# EAGLE design hdmi (EAGLE 7.3.0)
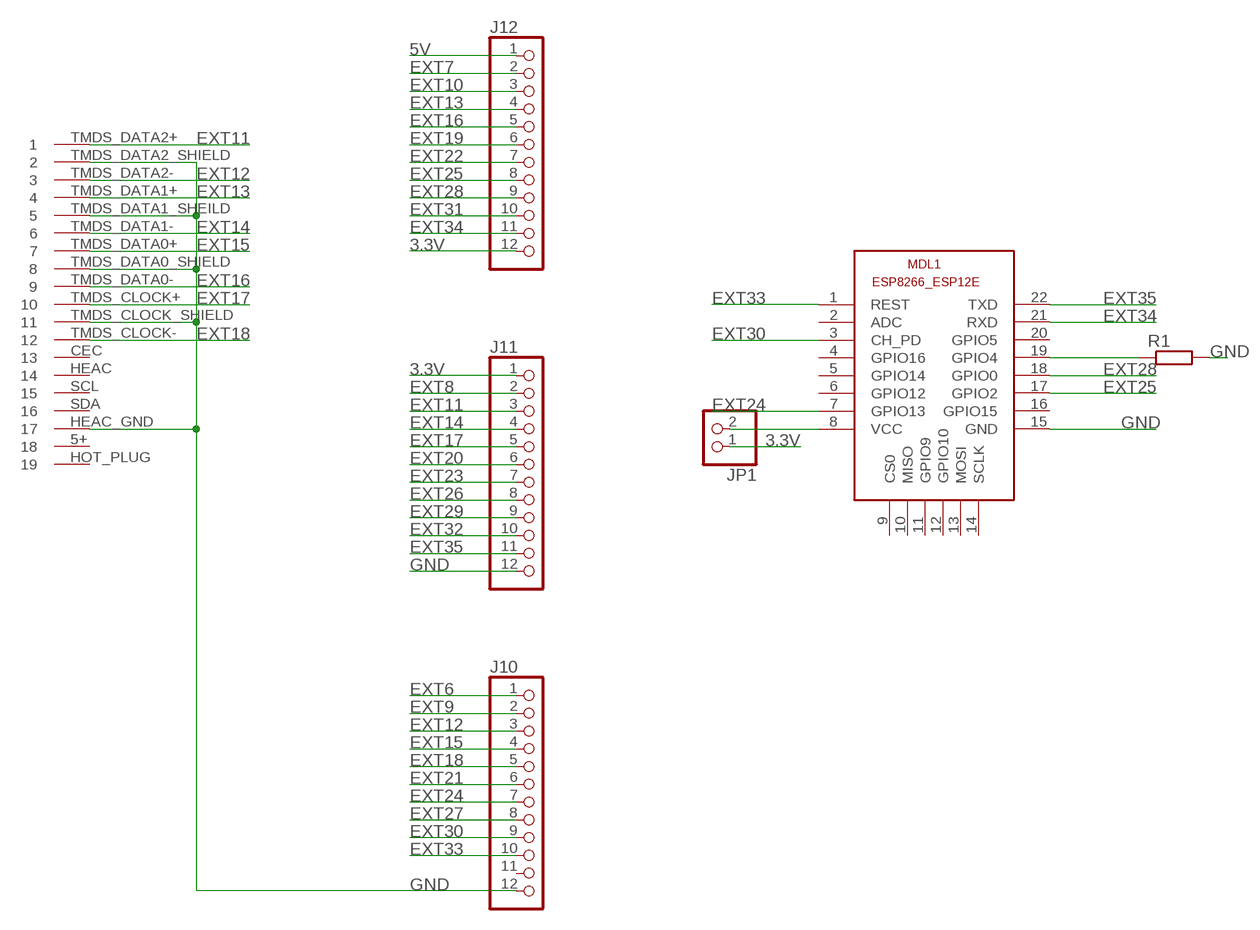
[diagram p0: schematic, sheet 1]

## Parts
J10  PINHD-1X12  [1X12]
J11  PINHD-1X12  [1X12]
J12  PINHD-1X12  [1X12]
JP1  PINHD-1X2/90  [1X02/90]
MDL1  ESP8266-12EESP8266-ESP12E  [ESP8266-ESP12E]
R1  R-EU_M0805  [M0805]
U$2  HDMI  [DS1115]

## Nets
3.3V: J11.1 J12.12 JP1.1
5V: J12.1
EXT6: J10.1
EXT7: J12.2
EXT8: J11.2
EXT9: J10.2
EXT10: J12.3
EXT11: J11.3 U$2.TMDS_DATA2+
EXT12: J10.3 U$2.TMDS_DATA2-
EXT13: J12.4 U$2.TMDS_DATA1+
EXT14: J11.4 U$2.TMDS_DATA1-
EXT15: J10.4 U$2.TMDS_DATA0+
EXT16: J12.5 U$2.TMDS_DATA0-
EXT17: J11.5 U$2.TMDS_CLOCK+
EXT18: J10.5 U$2.TMDS_CLOCK-
EXT19: J12.6
EXT20: J11.6
EXT21: J10.6
EXT22: J12.7
EXT23: J11.7
EXT24: J10.7 MDL1.7(GPIO13)
EXT25: J12.8 MDL1.17(GPIO2)
EXT26: J11.8
EXT27: J10.8
EXT28: J12.9 MDL1.18(GPIO0)
EXT29: J11.9
EXT30: J10.9 MDL1.3(CH_PD)
EXT31: J12.10
EXT32: J11.10
EXT33: J10.10 MDL1.1(REST)
EXT34: J12.11 MDL1.21(RXD)
EXT35: J11.11 MDL1.22(TXD)
GND: J10.12 J11.12 MDL1.15(GND) R1.2 U$2.HEAC_GND U$2.TMDS_CLOCK_SHIELD U$2.TMDS_DATA0_SHIELD U$2.TMDS_DATA1_SHEILD U$2.TMDS_DATA2_SHIELD
N$1: MDL1.19(GPIO4) R1.1
N$2: JP1.2 MDL1.8(VCC)
Unconnected: J10.11 MDL1.2(ADC) MDL1.4(GPIO16) MDL1.5(GPIO14) MDL1.6(GPIO12) MDL1.9(CS0) MDL1.10(MISO) MDL1.11(GPIO9) MDL1.12(GPIO10) MDL1.13(MOSI) MDL1.14(SCLK) MDL1.16(GPIO15) MDL1.20(GPIO5) U$2.5+ U$2.CEC U$2.HEAC U$2.HOT_PLUG U$2.SCL U$2.SDA

## Library data of the parts
J10-J12 = pinhead:PINHD-1X12: PIN HEADER
JP1 = pinhead:PINHD-1X2: PIN HEADER
MDL1 = ESP8266-ESP12E:ESP8266-12E: ESP8266-12E with additional I/O and GPIO04/05 corrected The author cannot warrant that this library is free from error or will meet your specific requirements. Created by PuceBaboon.com. Komagane, Nagano, JAPAN
R1 = rcl:R-EU_: RESISTOR, European symbol
U$2 = Connfly:HDMI: HDMI Socket

## Board
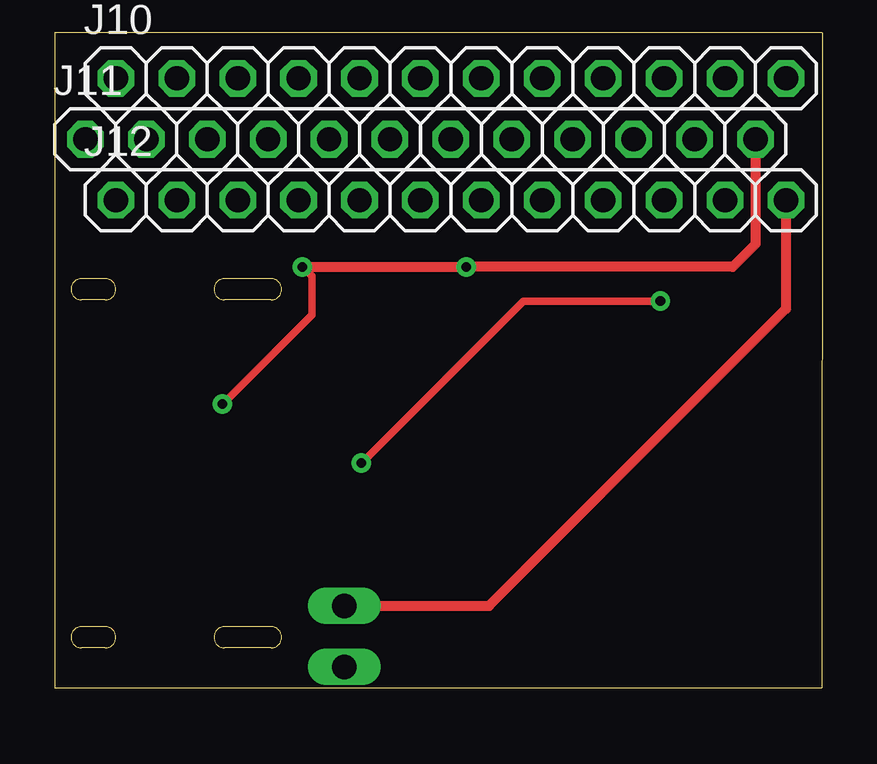
[diagram p1: board, top side]
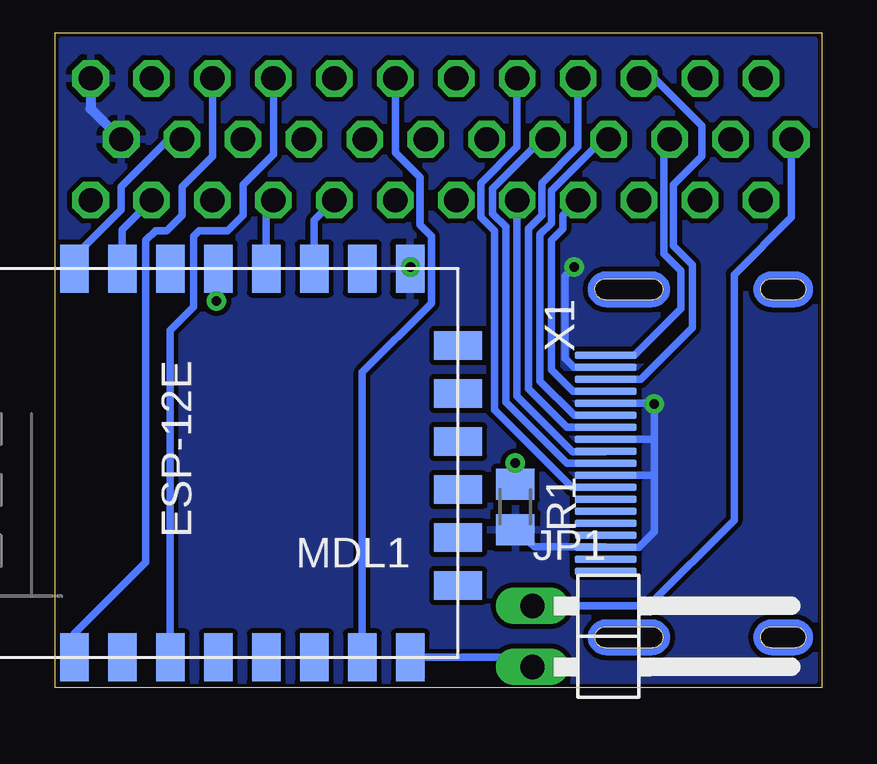
[diagram p2: board, bottom side, seen from below]

No outline drawn. Coordinates in mm, seen from the top.
Copper layers (1*16): Top 0.035mm / dielectric 1.5mm / Bottom 0.035mm
Design rules "default": minimum track width 10mil, minimum drill 24mil, track to track 8mil, track to pad 8mil, pad to pad 8mil, via to via 8mil, smd to smd 8mil, copper to edge 40mil, drill to drill 8mil, minimum pad ring 10mil, minimum via ring 8mil, stop-mask expansion 4mil, vias tented up to drill 0mil, thermal gap 10mil
Milling: 4 lines

### Footprints (pad centres in the part's own frame; a part is rotated, then mirrored left to right if it is on the bottom)
1X12 = drill 1.016 octagon: 1 -13.97,0; 2 -11.43,0; 3 -8.89,0; 4 -6.35,0; 5 -3.81,0; 6 -1.27,0; 7 1.27,0; 8 3.81,0; 9 6.35,0; 10 8.89,0; 11 11.43,0; 12 13.97,0
1X02/90 = drill 1.016 long: 1 -1.27,-3.81; 2 1.27,-3.81
ESP8266-ESP12E = smd 2 x 1.2: 1 0,16; 2 0,14; 3 0,12; 4 0,10; 5 0,8; 6 0,6; 7 0,4; 8 0,2; 15 16.2,2; 16 16.2,4; 17 16.2,6; 18 16.2,8; 19 16.2,10; 20 16.2,12; 21 16.2,14; 22 16.2,16 | smd 1.2 x 2: 9 3,0; 10 5,0; 11 7,0; 12 9,0; 13 11,0; 14 13,0
M0805 = smd 1.3 x 1.6: 1 -0.95,0; 2 0.95,0
DS1115 = smd 0.3 x 2.6: 5+ 3.85,7.9; CEC 6.35,7.9; HEAC 5.85,7.9; HEAC_GND 4.35,7.9; HOT_PLUG 3.35,7.9; SCL 5.35,7.9; SDA 4.85,7.9; TMDS_CLOCK+ 7.85,7.9; TMDS_CLOCK- 6.85,7.9; TMDS_CLOCK_SHIELD 7.35,7.9; TMDS_DATA0+ 9.35,7.9; TMDS_DATA0- 8.35,7.9; TMDS_DATA0_SHIELD 8.85,7.9; TMDS_DATA1+ 10.85,7.9; TMDS_DATA1- 9.85,7.9; TMDS_DATA1_SHEILD 10.35,7.9; TMDS_DATA2+ 12.35,7.9; TMDS_DATA2- 11.35,7.9; TMDS_DATA2_SHIELD 11.85,7.9

### Placement (x,y rotation side)
J10  16.51,25.4 0 top
J11  15.24,22.86 0 top
J12  16.51,20.32 0 top
JP1  8.26,2.14 270 bottom
MDL1  15.16,1.27 90 bottom
R1  12.78,7.54 270 bottom
U$2  1.11,1.51 90 bottom

### Tracks (layer width: path | path; a pad name or v marks a point on that pad's centre or on a via)
3.3V
  Top 0.406: J12.12 30.48,15.8 18.1,3.41 JP1.1
  Bottom 0.305: J11.1 1.27,19.61 3.65,17.22 3.65,6.99 7.22,3.41 JP1.1
EXT11
  Bottom 0.305: J11.3 6.59,22.62 6.59,18.1 5.87,17.38 5.87,15.8 7.81,13.86 U$2.TMDS_DATA2+
EXT12
  Bottom 0.305: J10.3 6.99,25.4 5,23.42 5,22.15 6.19,20.95 6.19,18.41 5.4,17.62 5.4,15 7.54,12.86 U$2.TMDS_DATA2-
EXT13
  Bottom 0.305: J12.4 10.79,19.68 10.79,19.13 11.27,18.65 11.27,13.26 10.37,12.36 U$2.TMDS_DATA1+
EXT14
  Bottom 0.305: J11.4 9.13,22.86 11.27,20.72 11.27,19.37 11.75,18.89 11.75,12.78 10.32,11.35 U$2.TMDS_DATA1-
EXT15
  Bottom 0.305: J10.4 10.16,22.54 11.67,21.03 11.67,19.68 12.22,19.13 12.22,12.46 10.62,10.86 U$2.TMDS_DATA0+
EXT16
  Bottom 0.305: J12.5 12.7,12.14 10.4,9.84 9.03,9.84 U$2.TMDS_DATA0-
EXT17
  Bottom 0.305: J11.5 11.67,22.86 13.73,20.8 13.73,19.76 13.18,19.21 13.18,11.91 10.63,9.36 U$2.TMDS_CLOCK+
EXT18
  Bottom 0.305: J10.5 12.7,22.54 14.21,21.03 14.21,19.61 13.65,19.05 13.65,11.59 10.42,8.36 U$2.TMDS_CLOCK-
EXT24
  Bottom 0.305: J10.7 17.78,22.3 16.75,21.27 16.75,19.29 16.27,18.81 16.27,16.03 19.16,13.14 MDL1.7
EXT25
  Bottom 0.305: MDL1.17 21.16,19.48 J12.8
EXT28
  Bottom 0.305: MDL1.18 23.16,20.02 J12.9
EXT30
  Bottom 0.305: MDL1.3 27.16,14.91 26.19,15.88 26.19,18.81 25.96,19.05 24.77,19.05 24.13,19.68 24.13,20.95 22.86,22.23 J10.9
EXT33
  Bottom 0.305: MDL1.1 31.16,2.26 28.18,5.24 28.18,18.65 27.78,19.05 27.3,19.05 26.67,19.68 26.67,20.88 25.4,22.15 J10.10
EXT34
  Bottom 0.305: MDL1.21 29.16,19.1 J12.11
EXT35
  Bottom 0.305: MDL1.22 31.16,17.97 29.21,19.92 29.21,20.88 27.23,22.86 J11.11
GND  (via drill 0.4)
  Top 0.305: v6.99,11.83 10.72,15.56 10.72,17.14 v10.32,17.54
  Top 0.406: J11.12 29.21,18.49 28.26,17.54 v17.14,17.54 v10.32,17.54
  Bottom 0.305: 6.99,8.89 6.99,6.51 7.64,5.86 U$2.HEAC_GND 9.03,5.87 11.99,5.87 R1.2 | 6.99,8.89 6.99,10.32 | 6.99,10.32 v6.99,11.83 7.02,11.86 U$2.TMDS_DATA1_SHEILD | U$2.TMDS_DATA2_SHIELD 10.34,13.36 10.72,13.73 10.72,17.14 v10.32,17.54 | U$2.TMDS_CLOCK_SHIELD 7.02,8.86 6.99,8.89 | U$2.TMDS_DATA0_SHIELD 7.02,10.36 6.99,10.32 | MDL1.15 17.16,17.53 v17.14,17.54
  Bottom 0.406: J10.12 30.48,24.13 J11.12
  pour Bottom: 0.32,26.99 31.67,26.99 31.67,0.32 0.32,0.32
N$1  (via drill 0.4)
  Top 0.305: v25.24,16.11 19.53,16.11 v12.78,9.37
  Bottom 0.305: v25.24,16.11 25.24,17.39 MDL1.19 | v12.78,9.37 R1.1
N$2
  Bottom 0.305: MDL1.8 12.46,1.27 JP1.2